# Altium schematic sheet 5-1 fgpa power.SchDoc
size A4; SheetNumber: 5; SheetTotal: 13
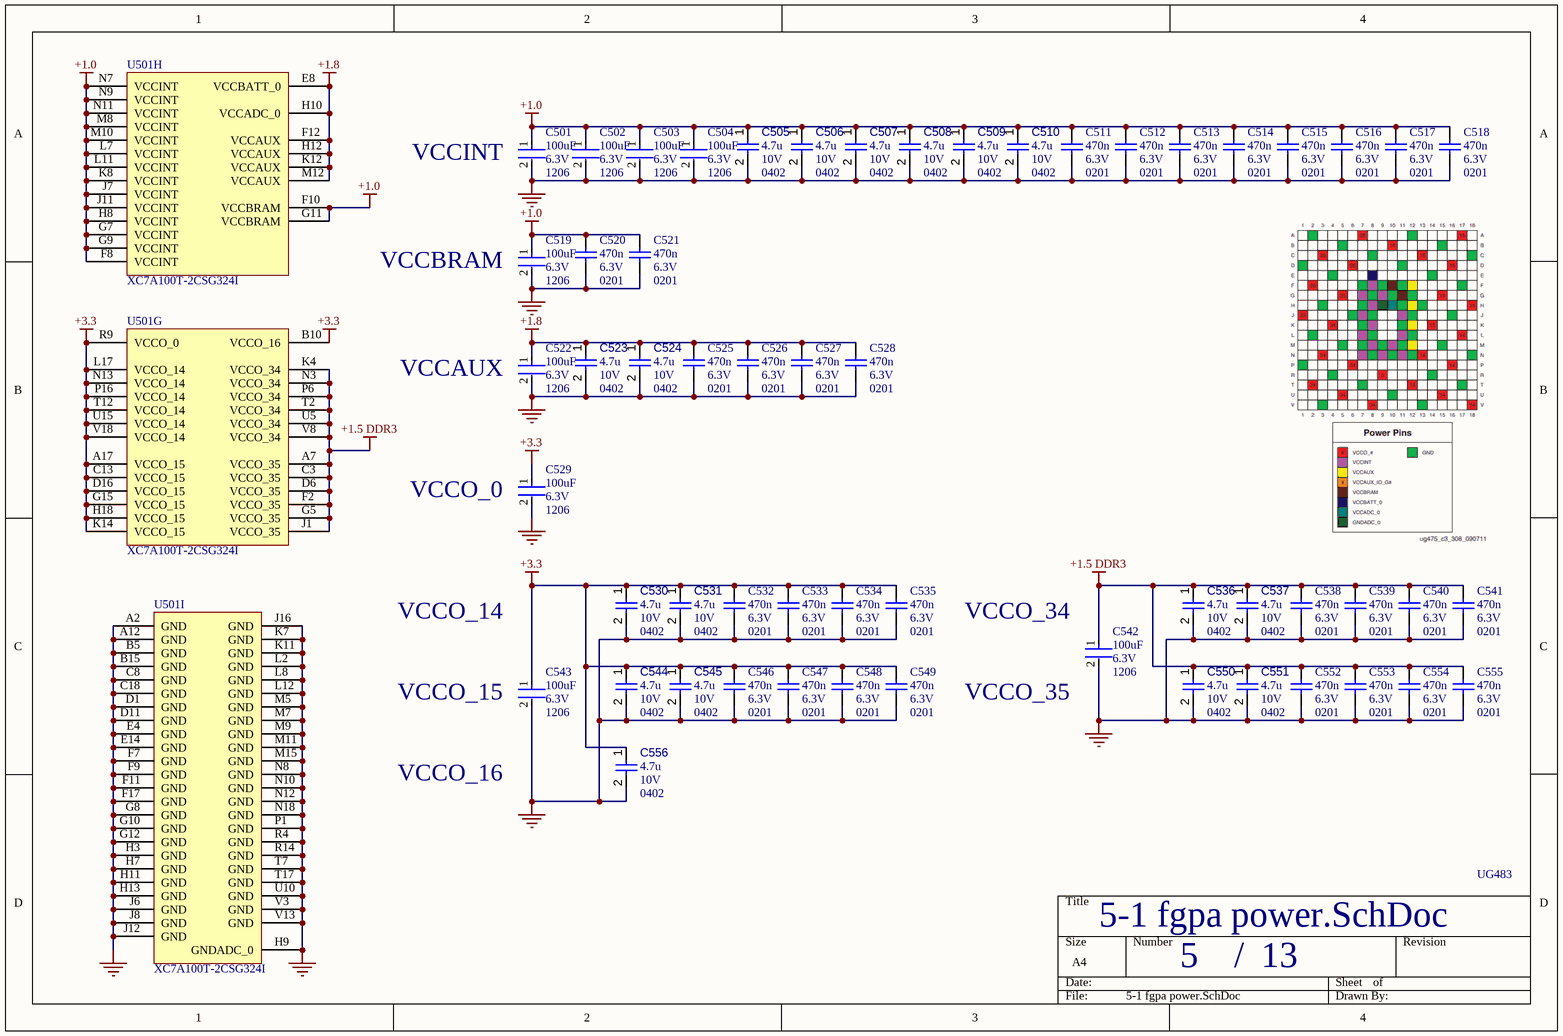
[diagram p0: 5-1 fgpa power.SchDoc]

## Parts
C501  Case Code (Imperial): 1206  Voltage Rating (DC): 6.3V  Capacitance: 100uF  [FP-C1206C-EH-MFG]  (hidden comment: C1206C107M9PACTU)
C502  Case Code (Imperial): 1206  Voltage Rating (DC): 6.3V  Capacitance: 100uF  [FP-C1206C-EH-MFG]  (hidden comment: C1206C107M9PACTU)
C503  Case Code (Imperial): 1206  Voltage Rating (DC): 6.3V  Capacitance: 100uF  [FP-C1206C-EH-MFG]  (hidden comment: C1206C107M9PACTU)
C504  Case Code (Imperial): 1206  Voltage Rating (DC): 6.3V  Capacitance: 100uF  [FP-C1206C-EH-MFG]  (hidden comment: C1206C107M9PACTU)
C505  value 4.7u  Case/Package: 0402  Voltage Rating: 10V  [CAPC0402(1005)60_L]  (hidden comment: Capacitors,0402,4.7u,10V)
C506  value 4.7u  Case/Package: 0402  Voltage Rating: 10V  [CAPC0402(1005)60_L]  (hidden comment: Capacitors,0402,4.7u,10V)
C507  value 4.7u  Case/Package: 0402  Voltage Rating: 10V  [CAPC0402(1005)60_L]  (hidden comment: Capacitors,0402,4.7u,10V)
C508  value 4.7u  Case/Package: 0402  Voltage Rating: 10V  [CAPC0402(1005)60_L]  (hidden comment: Capacitors,0402,4.7u,10V)
C509  value 4.7u  Case/Package: 0402  Voltage Rating: 10V  [CAPC0402(1005)60_L]  (hidden comment: Capacitors,0402,4.7u,10V)
C510  value 4.7u  Case/Package: 0402  Voltage Rating: 10V  [CAPC0402(1005)60_L]  (hidden comment: Capacitors,0402,4.7u,10V)
C511  value 470n  Voltage Rating: 6.3V  Package: 0201  [CAPC0603X33X15LL03T05]  (hidden comment: 02016D474KAT2A)
C512  value 470n  Voltage Rating: 6.3V  Package: 0201  [CAPC0603X33X15LL03T05]  (hidden comment: 02016D474KAT2A)
C513  value 470n  Voltage Rating: 6.3V  Package: 0201  [CAPC0603X33X15LL03T05]  (hidden comment: 02016D474KAT2A)
C514  value 470n  Voltage Rating: 6.3V  Package: 0201  [CAPC0603X33X15LL03T05]  (hidden comment: 02016D474KAT2A)
C515  value 470n  Voltage Rating: 6.3V  Package: 0201  [CAPC0603X33X15LL03T05]  (hidden comment: 02016D474KAT2A)
C516  value 470n  Voltage Rating: 6.3V  Package: 0201  [CAPC0603X33X15LL03T05]  (hidden comment: 02016D474KAT2A)
C517  value 470n  Voltage Rating: 6.3V  Package: 0201  [CAPC0603X33X15LL03T05]  (hidden comment: 02016D474KAT2A)
C518  value 470n  Voltage Rating: 6.3V  Package: 0201  [CAPC0603X33X15LL03T05]  (hidden comment: 02016D474KAT2A)
C519  Case Code (Imperial): 1206  Voltage Rating (DC): 6.3V  Capacitance: 100uF  [FP-C1206C-EH-MFG]  (hidden comment: C1206C107M9PACTU)
C520  value 470n  Voltage Rating: 6.3V  Package: 0201  [CAPC0603X33X15LL03T05]  (hidden comment: 02016D474KAT2A)
C521  value 470n  Voltage Rating: 6.3V  Package: 0201  [CAPC0603X33X15LL03T05]  (hidden comment: 02016D474KAT2A)
C522  Case Code (Imperial): 1206  Voltage Rating (DC): 6.3V  Capacitance: 100uF  [FP-C1206C-EH-MFG]  (hidden comment: C1206C107M9PACTU)
C523  value 4.7u  Case/Package: 0402  Voltage Rating: 10V  [CAPC0402(1005)60_L]  (hidden comment: Capacitors,0402,4.7u,10V)
C524  value 4.7u  Case/Package: 0402  Voltage Rating: 10V  [CAPC0402(1005)60_L]  (hidden comment: Capacitors,0402,4.7u,10V)
C525  value 470n  Voltage Rating: 6.3V  Package: 0201  [CAPC0603X33X15LL03T05]  (hidden comment: 02016D474KAT2A)
C526  value 470n  Voltage Rating: 6.3V  Package: 0201  [CAPC0603X33X15LL03T05]  (hidden comment: 02016D474KAT2A)
C527  value 470n  Voltage Rating: 6.3V  Package: 0201  [CAPC0603X33X15LL03T05]  (hidden comment: 02016D474KAT2A)
C528  value 470n  Voltage Rating: 6.3V  Package: 0201  [CAPC0603X33X15LL03T05]  (hidden comment: 02016D474KAT2A)
C529  Case Code (Imperial): 1206  Voltage Rating (DC): 6.3V  Capacitance: 100uF  [FP-C1206C-EH-MFG]  (hidden comment: C1206C107M9PACTU)
C530  value 4.7u  Case/Package: 0402  Voltage Rating: 10V  [CAPC0402(1005)60_L]  (hidden comment: Capacitors,0402,4.7u,10V)
C531  value 4.7u  Case/Package: 0402  Voltage Rating: 10V  [CAPC0402(1005)60_L]  (hidden comment: Capacitors,0402,4.7u,10V)
C532  value 470n  Voltage Rating: 6.3V  Package: 0201  [CAPC0603X33X15LL03T05]  (hidden comment: 02016D474KAT2A)
C533  value 470n  Voltage Rating: 6.3V  Package: 0201  [CAPC0603X33X15LL03T05]  (hidden comment: 02016D474KAT2A)
C534  value 470n  Voltage Rating: 6.3V  Package: 0201  [CAPC0603X33X15LL03T05]  (hidden comment: 02016D474KAT2A)
C535  value 470n  Voltage Rating: 6.3V  Package: 0201  [CAPC0603X33X15LL03T05]  (hidden comment: 02016D474KAT2A)
C536  value 4.7u  Case/Package: 0402  Voltage Rating: 10V  [CAPC0402(1005)60_L]  (hidden comment: Capacitors,0402,4.7u,10V)
C537  value 4.7u  Case/Package: 0402  Voltage Rating: 10V  [CAPC0402(1005)60_L]  (hidden comment: Capacitors,0402,4.7u,10V)
C538  value 470n  Voltage Rating: 6.3V  Package: 0201  [CAPC0603X33X15LL03T05]  (hidden comment: 02016D474KAT2A)
C539  value 470n  Voltage Rating: 6.3V  Package: 0201  [CAPC0603X33X15LL03T05]  (hidden comment: 02016D474KAT2A)
C540  value 470n  Voltage Rating: 6.3V  Package: 0201  [CAPC0603X33X15LL03T05]  (hidden comment: 02016D474KAT2A)
C541  value 470n  Voltage Rating: 6.3V  Package: 0201  [CAPC0603X33X15LL03T05]  (hidden comment: 02016D474KAT2A)
C542  Case Code (Imperial): 1206  Voltage Rating (DC): 6.3V  Capacitance: 100uF  [FP-C1206C-EH-MFG]  (hidden comment: C1206C107M9PACTU)
C543  Case Code (Imperial): 1206  Voltage Rating (DC): 6.3V  Capacitance: 100uF  [FP-C1206C-EH-MFG]  (hidden comment: C1206C107M9PACTU)
C544  value 4.7u  Case/Package: 0402  Voltage Rating: 10V  [CAPC0402(1005)60_L]  (hidden comment: Capacitors,0402,4.7u,10V)
C545  value 4.7u  Case/Package: 0402  Voltage Rating: 10V  [CAPC0402(1005)60_L]  (hidden comment: Capacitors,0402,4.7u,10V)
C546  value 470n  Voltage Rating: 6.3V  Package: 0201  [CAPC0603X33X15LL03T05]  (hidden comment: 02016D474KAT2A)
C547  value 470n  Voltage Rating: 6.3V  Package: 0201  [CAPC0603X33X15LL03T05]  (hidden comment: 02016D474KAT2A)
C548  value 470n  Voltage Rating: 6.3V  Package: 0201  [CAPC0603X33X15LL03T05]  (hidden comment: 02016D474KAT2A)
C549  value 470n  Voltage Rating: 6.3V  Package: 0201  [CAPC0603X33X15LL03T05]  (hidden comment: 02016D474KAT2A)
C550  value 4.7u  Case/Package: 0402  Voltage Rating: 10V  [CAPC0402(1005)60_L]  (hidden comment: Capacitors,0402,4.7u,10V)
C551  value 4.7u  Case/Package: 0402  Voltage Rating: 10V  [CAPC0402(1005)60_L]  (hidden comment: Capacitors,0402,4.7u,10V)
C552  value 470n  Voltage Rating: 6.3V  Package: 0201  [CAPC0603X33X15LL03T05]  (hidden comment: 02016D474KAT2A)
C553  value 470n  Voltage Rating: 6.3V  Package: 0201  [CAPC0603X33X15LL03T05]  (hidden comment: 02016D474KAT2A)
C554  value 470n  Voltage Rating: 6.3V  Package: 0201  [CAPC0603X33X15LL03T05]  (hidden comment: 02016D474KAT2A)
C555  value 470n  Voltage Rating: 6.3V  Package: 0201  [CAPC0603X33X15LL03T05]  (hidden comment: 02016D474KAT2A)
C556  value 4.7u  Case/Package: 0402  Voltage Rating: 10V  [CAPC0402(1005)60_L]  (hidden comment: Capacitors,0402,4.7u,10V)
U501  XC7A100T-2CSG324I  [CSG324]  (parts G,H,I of 9)

## Nets
+1.0: C501.1 C502.1 C503.1 C504.1 C505.1 C506.1 C507.1 C508.1 C509.1 C510.1 C511.1 C512.1 C513.1 C514.1 C515.1 C516.1 C517.1 C518.1 C519.1 C520.1 C521.1 U501.F8(VCCINT) U501.F10(VCCBRAM) U501.G7(VCCINT) U501.G9(VCCINT) U501.G11(VCCBRAM) U501.H8(VCCINT) U501.J7(VCCINT) U501.J11(VCCINT) U501.K8(VCCINT) U501.L7(VCCINT) U501.L11(VCCINT) U501.M8(VCCINT) U501.M10(VCCINT) U501.N7(VCCINT) U501.N9(VCCINT) U501.N11(VCCINT)
+1.5 DDR3: C536.1 C537.1 C538.1 C539.1 C540.1 C541.1 C542.1 C550.1 C551.1 C552.1 C553.1 C554.1 C555.1 U501.A7(VCCO_35) U501.C3(VCCO_35) U501.D6(VCCO_35) U501.F2(VCCO_35) U501.G5(VCCO_35) U501.J1(VCCO_35) U501.K4(VCCO_34) U501.N3(VCCO_34) U501.P6(VCCO_34) U501.T2(VCCO_34) U501.U5(VCCO_34) U501.V8(VCCO_34)
+1.8: C522.1 C523.1 C524.1 C525.1 C526.1 C527.1 C528.1 U501.E8(VCCBATT_0) U501.F12(VCCAUX) U501.H10(VCCADC_0) U501.H12(VCCAUX) U501.K12(VCCAUX) U501.M12(VCCAUX)
+3.3: C529.1 C530.1 C531.1 C532.1 C533.1 C534.1 C535.1 C543.1 C544.1 C545.1 C546.1 C547.1 C548.1 C549.1 C556.1 U501.A17(VCCO_15) U501.B10(VCCO_16) U501.C13(VCCO_15) U501.D16(VCCO_15) U501.G15(VCCO_15) U501.H18(VCCO_15) U501.K14(VCCO_15) U501.L17(VCCO_14) U501.N13(VCCO_14) U501.P16(VCCO_14) U501.R9(VCCO_0) U501.T12(VCCO_14) U501.U15(VCCO_14) U501.V18(VCCO_14)
GND: C501.2 C502.2 C503.2 C504.2 C505.2 C506.2 C507.2 C508.2 C509.2 C510.2 C511.2 C512.2 C513.2 C514.2 C515.2 C516.2 C517.2 C518.2 C519.2 C520.2 C521.2 C522.2 C523.2 C524.2 C525.2 C526.2 C527.2 C528.2 C529.2 C530.2 C531.2 C532.2 C533.2 C534.2 C535.2 C536.2 C537.2 C538.2 C539.2 C540.2 C541.2 C542.2 C543.2 C544.2 C545.2 C546.2 C547.2 C548.2 C549.2 C550.2 C551.2 C552.2 C553.2 C554.2 C555.2 C556.2 U501.A2(GND) U501.A12(GND) U501.B5(GND) U501.B15(GND) U501.C8(GND) U501.C18(GND) U501.D1(GND) U501.D11(GND) U501.E4(GND) U501.E14(GND) U501.F7(GND) U501.F9(GND) U501.F11(GND) U501.F17(GND) U501.G8(GND) U501.G10(GND) U501.G12(GND) U501.H3(GND) U501.H7(GND) U501.H9(GNDADC_0) U501.H11(GND) U501.H13(GND) U501.J6(GND) U501.J8(GND) U501.J12(GND) U501.J16(GND) U501.K7(GND) U501.K11(GND) U501.L2(GND) U501.L8(GND) U501.L12(GND) U501.M5(GND) U501.M7(GND) U501.M9(GND) U501.M11(GND) U501.M15(GND) U501.N8(GND) U501.N10(GND) U501.N12(GND) U501.N18(GND) U501.P1(GND) U501.R4(GND) U501.R14(GND) U501.T7(GND) U501.T17(GND) U501.U10(GND) U501.V3(GND) U501.V13(GND)

## Notes on the sheet
- (near C501) VCCINT
- (near C519) VCCBRAM
- (near C522) VCCAUX
- (near C529) VCCO_0
- VCCO_14
- (near C542) VCCO_34
- (near C543) VCCO_15
- (near C542) VCCO_35
- VCCO_16
- UG483
- /

## Library data of the parts
C501-C504 C519 C522 C529 C542 C543 = CMP-1037-05005-3: CAP CER 100UF 6.3V X5R 1206; Dielectric Material: Ceramic; Tolerance: 2%; Dissipation Factor: 5%; Min Operating Temperature: -55°C; Case Code (Metric): 3216; Depth: 1.6mm; Dielectric: X5R; Max Operating Temperature: 85°C; Packaging: Tape and Reel; Construction: Flat; Series: C; Case/Package: 1206; Radiation Hardening: No; Termination: SMD/SMT; Voltage Rating: 6.3V; Number of Pins: 2; RoHS Compliant: Yes; Height: 1.6mm; Lead Free: Lead Free; Voltage: 6.3V; REACH SVHC: No SVHC; Length: 3.2mm; Mount: Surface Mount; Package Quantity: 1; Thickness: 0.071inch; Width: 0.063inch
C505-C510 C523 C524 C530 C531 C536 C537 C544 C545 C550 C551 C556 = Capacitors: Capacitor; Component Type: Capacitors
C511-C518 C520 C521 C525-C528 C532-C535 C538-C541 C546-C549 C552-C555 = CMP-2010-00405-1: Manufacturer: AVX Interconnect / Elco; Part Number: 02016D474KAT2A
U501 = CMP-0364-00002-3: Artix-7 FPGA, 210 User I/Os, 0 GTP, 324-Ball BGA, Speed Grade 2, Extended Grade, Pb-Free; Manufacturer: Xilinx; Block RAM Blocks (36Kb): 135; Logic Cells: 101440; Clock Mgmt Tiles (CMTs): 6; Block RAM Blocks (18Kb): 270; CLBs (Slices): 15850; Block RAM Blocks (Max Kb): 4860; Max User I/O: 300; Speed Grade: -2; DSP48E1 Slices: 240; ComponentLink5URL: http://www.xilinx.com/support/documentation/user_guides/ug475_7Series_Pkg_Pinout.pdf; ComponentLink4Description: Package File; PackageDescription: Wire-Bond Chip-Scale BGA, Body 15 x 15 mm, 0.8 mm Pitch; RoHS: Pb-Free; ComponentLink5Description: Packaging and Pinout; ComponentLink2URL: http://www.xilinx.com/support/documentation/user_guides/ug475_7Series_Pkg_Pinout.pdf; ComponentLink2Description: Package Specification; PartNumber: XC7A100T-2CSG324I; Mounting Technology: Surface Mount; ComponentLink3Description: DC and Switching Characteristics; PackageVersion: Rev 1.8; Code_JEDEC: MO-275-KKAC-1; PackageReference: CSG324; NexusDeviceID: XC7A100T-2CSG324I; ComponentLink4URL: http://www.xilinx.com/support/packagefiles/a7packages/xc7a100tcsg324pkg.txt; ComponentLink3URL: http://www.xilinx.com/support/documentation/data_sheets/ds181_Artix_7_Data_Sheet.pdf; ComponentLink1Description: Datasheet; DatasheetVersion: v1.12; ComponentLink1URL: http://www.xilinx.com/support/documentation/data_sheets/ds180_7Series_Overview.pdf; Generic Part Number: XC7A100T; CLBs (Max Distributed RAM Kb): 1188